# EasyEDA Pro project 数控UPS.epro, schematic 12-5v
Create Date: 2023-06-05; Page Name: P1; Project Name: MP2236高效率buck5V 3.3 V2.5V电压模块（已验证）; Schematic Name: Schematic1; Update Date: 2023-06-05; Company: 嘉立创EDA; Page Size: A4; Version: V1.0
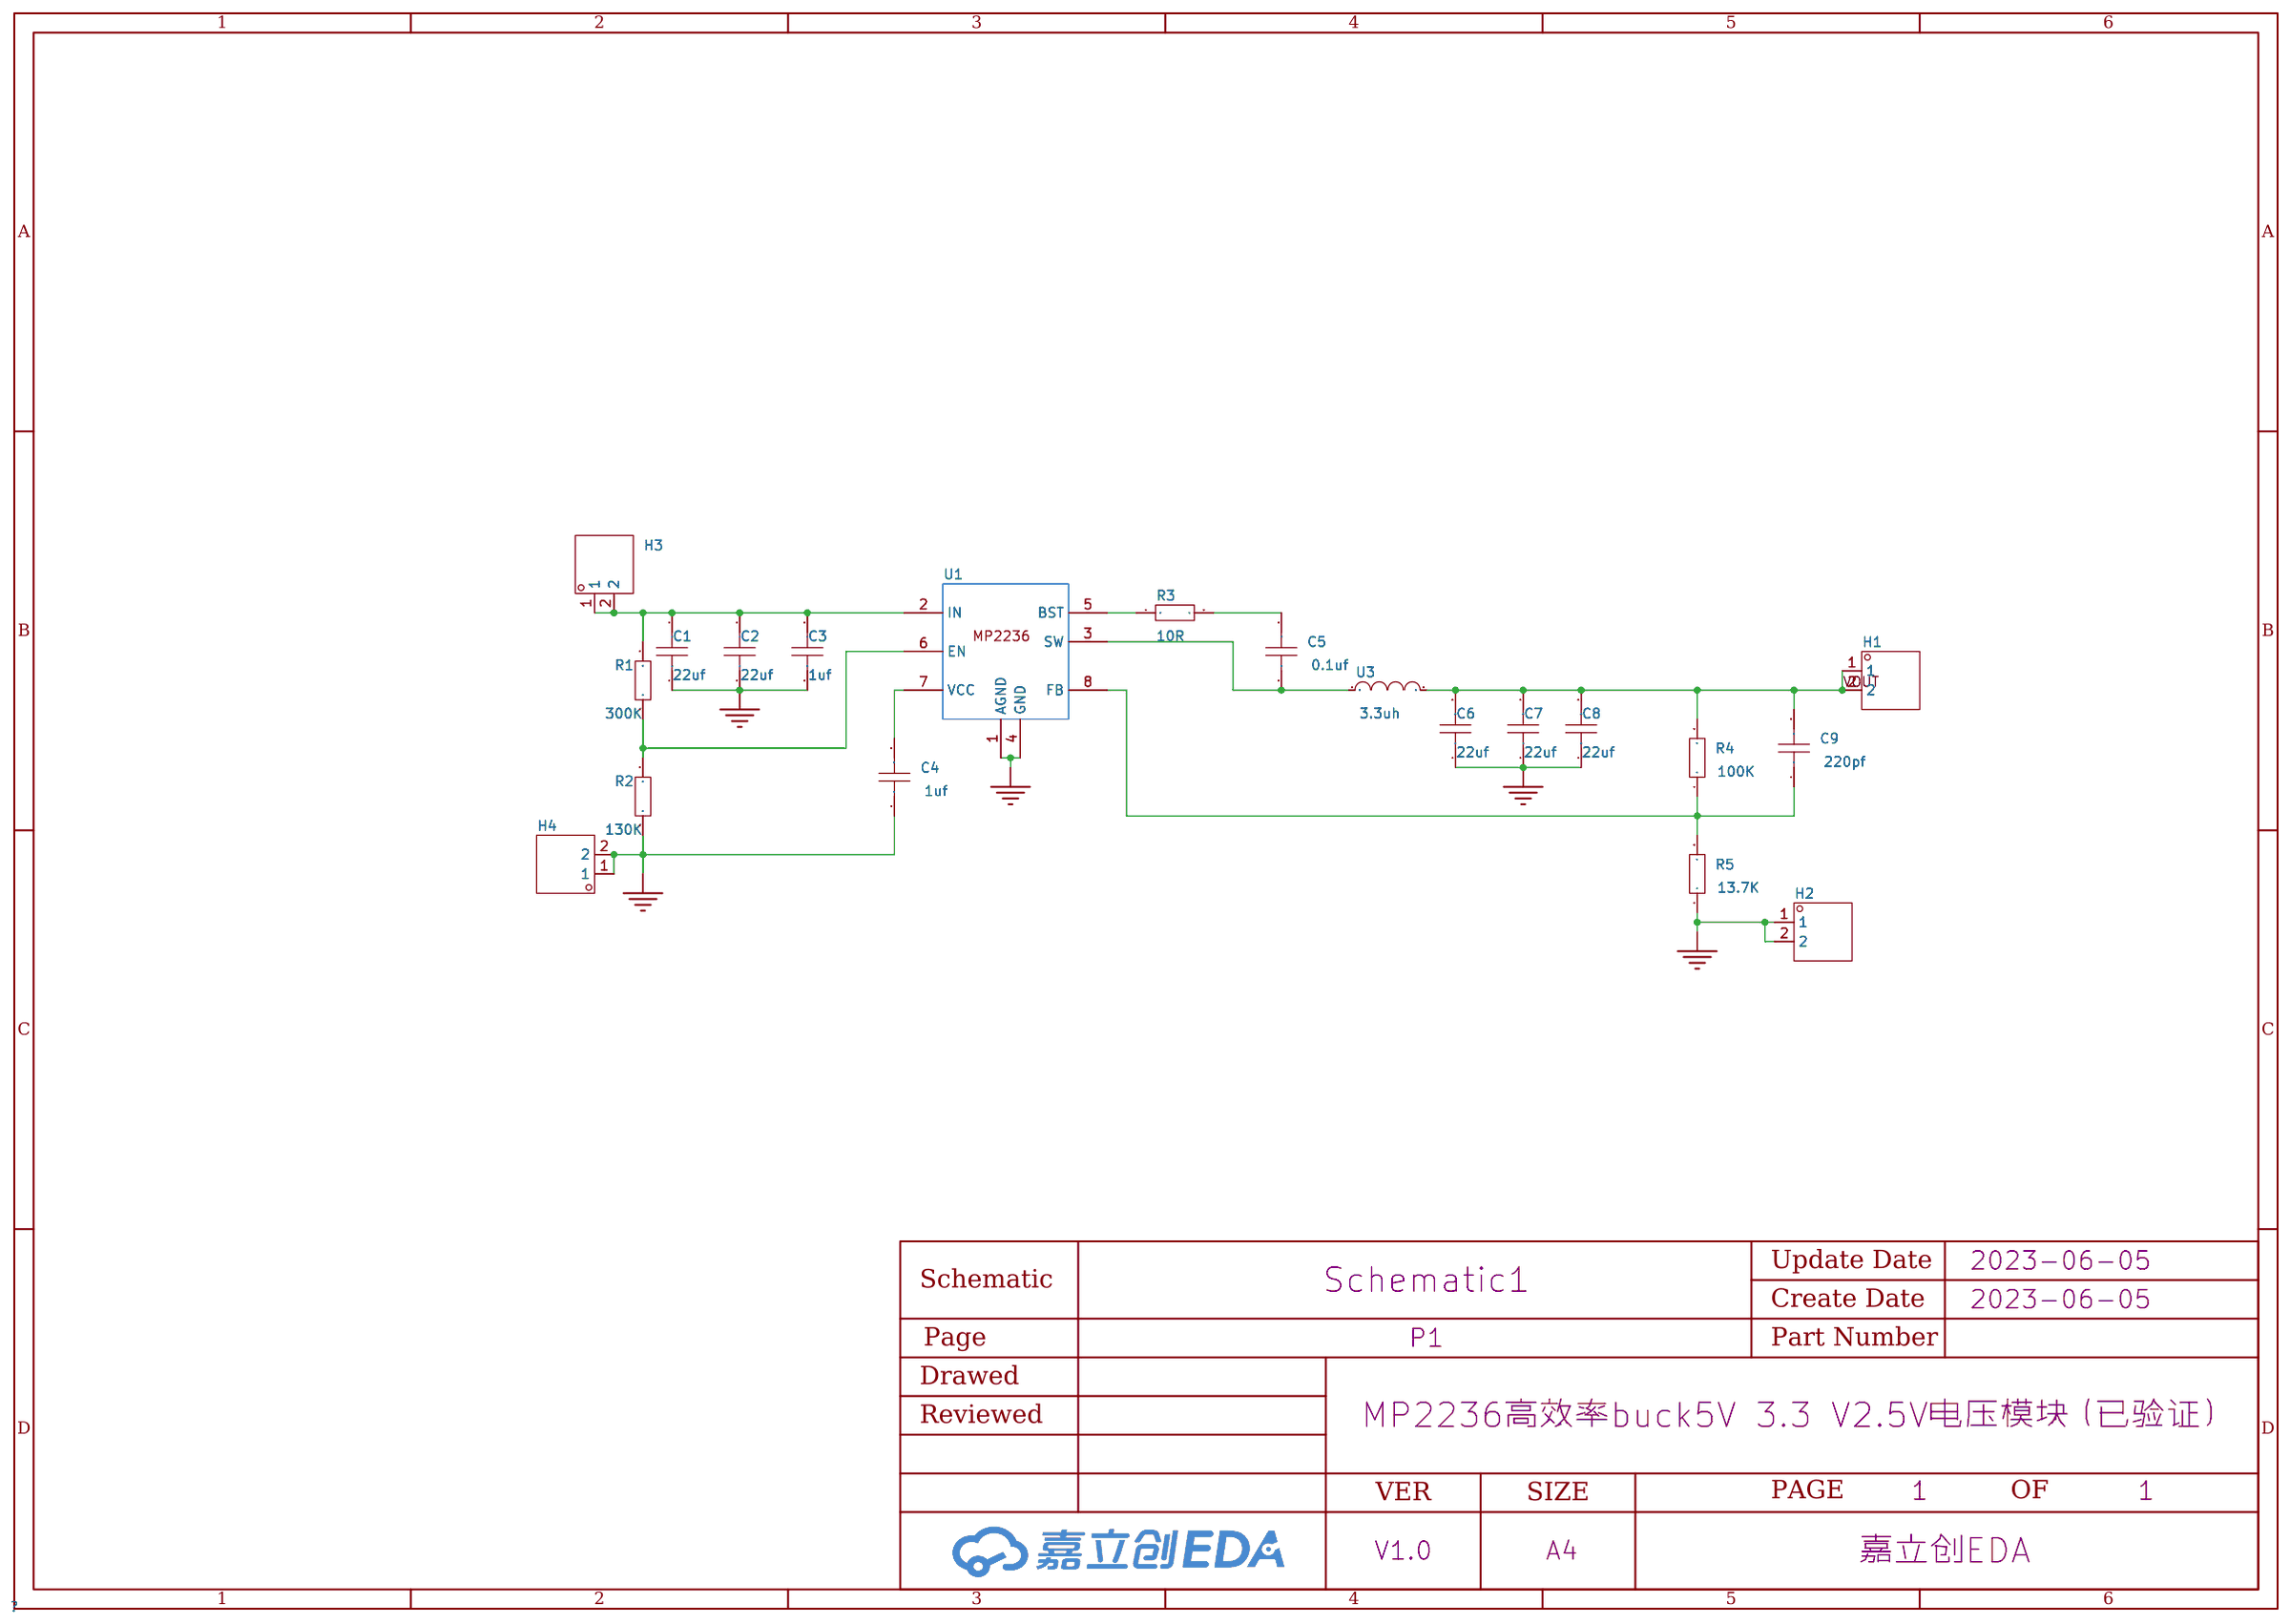
[diagram p0: schematic sheet]

## Parts
C1  22uf  [C0805]
C2  22uf  [C0805]
C3  1uf  [C0805]
C4  1uf  [C0805]
C5  0.1uf  [C0805]
C6  22uf  [C0805]
C7  22uf  [C0805]
C8  22uf  [C0805]
C9  220pf  [C0805]
H1  -  [HDR-TH_2P-P2.54-V-M-1]
H2  -  [HDR-TH_2P-P2.54-V-M-1]
H3  -  [HDR-TH_2P-P2.54-V-M-1]
H4  -  [HDR-TH_2P-P2.54-V-M-1]
R1  300K  [R0805]
R2  130K  [R0805]
R3  10R  [R0805]
R4  100K  [R0805]
R5  13.7K  [R0805]
U1  -  [MP2236]
U3  3.3uh  [IND-SMD_L6.8-W6.8_SMMS0630]

## Library data of the parts
C1-C9 = CAP_0805: Supplier Footprint: 0805
H1-H4 = HDR-M_2.54_1x2P: Supplier Part: C124375; Supplier Footprint: 插件
R1-R5 = Res_0805: Supplier Footprint: 0805
U1 = MP2236
U3 = 贴片电感1ROI: Supplier Part: C9900016446; Supplier Footprint: ND-SMD_L6.8-W6.8_SMMS0630; JLCPCB Part Class: 扩展库; Datasheet: https://atta.szlcsc.comnull; Supplier: LCSC

## Nets
GND: C1.1 C2.1 C3.1 C4.1 C6.1 C7.1 C8.1 H2.1 H2.2 H4.1 H4.2 R2.1 R5.1 U1.1(AGND) U1.4(GND)
VOUT: C6.2 C7.2 C8.2 C9.2 H1.1 H1.2 R4.2 U3.2
Net-(C1-2): C1.2 C2.2 C3.2 H3.1 H3.2 R1.2 U1.2(IN)
Net-(C4-2): C4.2 U1.7(VCC)
Net-(C5-1): C5.1 U1.3(SW) U3.1
Net-(C5-2): C5.2 R3.2
Net-(C9-1): C9.1 R4.1 R5.2 U1.8(FB)
Net-(R1-1): R1.1 R2.2 U1.6(EN)
Net-(R3-1): R3.1 U1.5(BST)
